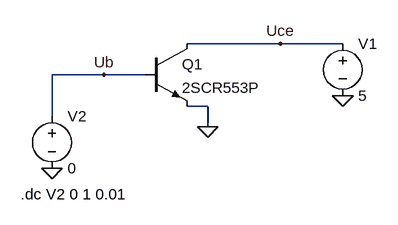
[diagram p0: schematic Draft1.asc]
Draft1.asc, the LTspice schematic file:
Version 4
SHEET 1 880 680
WIRE 480 96 336 96
WIRE 576 96 480 96
WIRE 208 144 128 144
WIRE 272 144 208 144
WIRE 368 192 336 192
WIRE 128 208 128 144
WIRE 368 224 368 192
FLAG 576 176 0
FLAG 128 288 0
FLAG 368 224 0
FLAG 208 144 Ub
FLAG 480 96 Uce
SYMBOL npn 272 96 R0
SYMATTR InstName Q1
SYMATTR Value 2SCR553P
SYMBOL voltage 576 80 R0
WINDOW 123 0 0 Left 0
WINDOW 39 0 0 Left 0
SYMATTR InstName V1
SYMATTR Value 5
SYMBOL voltage 128 192 R0
WINDOW 123 0 0 Left 0
WINDOW 39 0 0 Left 0
SYMATTR InstName V2
SYMATTR Value 0
TEXT 80 328 Left 2 !.dc V2 0 1 0.01

The netlist it stands for:
* Draft1.asc
Q1 Uce Ub 0 0 2SCR553P
V1 Uce 0 5
V2 Ub 0 0
.model NPN NPN
.model PNP PNP
.lib standard.bjt
.dc V2 0 1 0.01
.backanno
.end